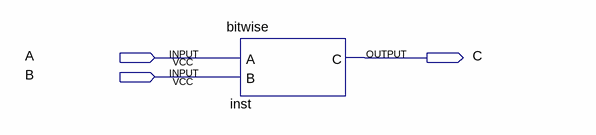
[diagram p0: schematic sheet]
// Quartus schematic bitwise_test.bdf as structural Verilog: 1 symbols, 3 pins
module bitwise_test (
  input  A,
  input  B,
  output C
);

  bitwise inst (.A(A), .B(B), .C(C));
endmodule
